# Altium schematic sheet Pulser.SchDoc
size A4; SheetNumber: 1; SheetTotal: 5
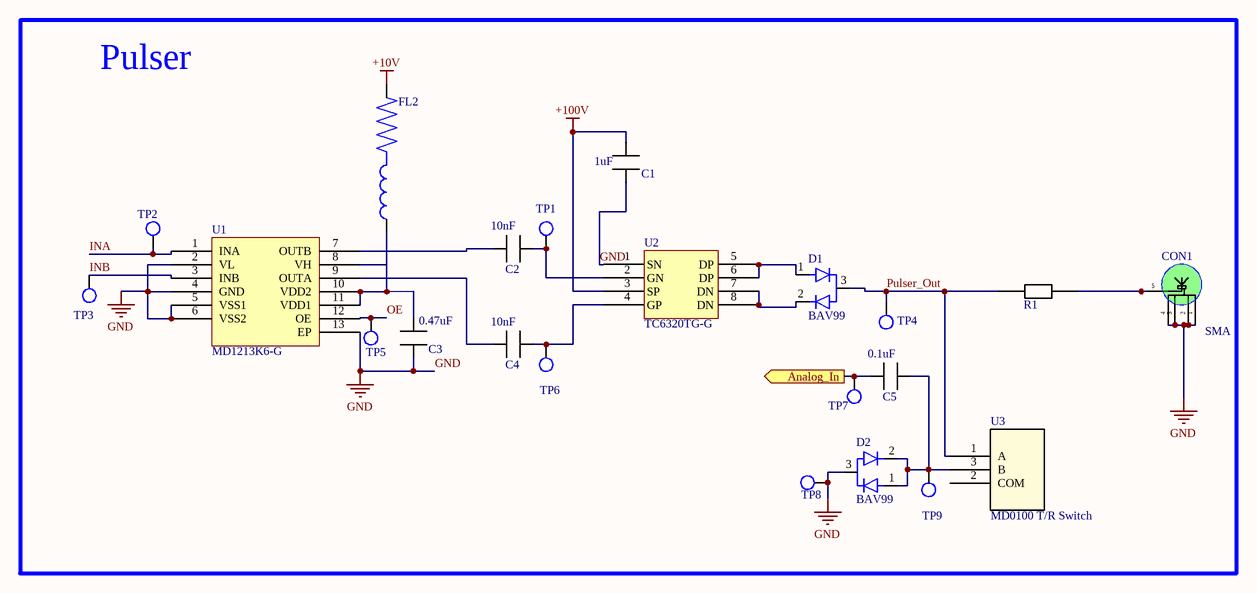
[diagram p0: Pulser.SchDoc]

## Parts
C1  1uF  [CAP_1206]
C2  10nF  [CAP_0805]
C3  0.47uF  [CAP_0805]
C4  10nF  [CAP_0805]
C5  0.1uF  [CAP_0805]
CON1  SMA  [A-SMA-KWE-15.1A]
D1  BAV99  [DIO_BAV99]
D2  BAV99  [DIO_BAV99]
FL2  (no value)  [BEAD1206S601A40T]
R1  200R  [RES_0805]  (value not drawn)
TP1  TP  [CON_TP]  (value not drawn)
TP2  TP  [CON_TP]  (value not drawn)
TP3  TP  [CON_TP]  (value not drawn)
TP4  TP  [CON_TP]  (value not drawn)
TP5  TP  [CON_TP]  (value not drawn)
TP6  TP  [CON_TP]  (value not drawn)
TP7  TP  [CON_TP]  (value not drawn)
TP8  TP  [CON_TP]  (value not drawn)
TP9  TP  [CON_TP]  (value not drawn)
U1  MD1213K6-G  [QFN80P400X400X90-13N]
U2  TC6320TG-G  [SOIC127P600X175-8N]
U3  MD0100 T/R Switch  [TO-243AA_MCH]

## Blocks framed on the sheet
Pulser: C1-C5 CON1 D1 D2 FL2 R1 TP1-TP9 U1-U3

## Ports
Analog_In (out)

## Nets
+10V: FL2.2
+100V: C1.2 U2.3(SP)
GND: C1.1 C3.2 CON1.1 CON1.2 CON1.3 CON1.4 D2.3 TP8.1(A1) U1.2(VL) U1.4(GND) U1.5(VSS1) U1.6(VSS2) U1.13(EP) U2.1(SN)
Analog_In: C5.1 TP7.1(A1) ; port Analog_In
INA: TP2.1(A1) U1.1(INA)
INB: TP3.1(A1) U1.3(INB)
OE: TP5.1(A1) U1.12(OE)
Pulser_Out: D1.3 R1.1 TP4.1(A1) U3.1(A)
NetC2_1: C2.1 U1.7(OUTB)
NetC2_2: C2.2 TP1.1(A1) U2.2(GN)
NetC3_1: C3.1 FL2.1 U1.8(VH) U1.10(VDD2) U1.11(VDD1)
NetC4_1: C4.1 U1.9(OUTA)
NetC4_2: C4.2 TP6.1(A1) U2.4(GP)
NetC5_2: C5.2 D2.1 D2.2 TP9.1(A1) U3.3(B)
NetCON1_5: CON1.5 R1.2
NetD1_1: D1.1 U2.5(DP) U2.6(DP)
NetD1_2: D1.2 U2.7(DN) U2.8(DN)

Not connected (* = marked no-connect by the designer): U3 2(COM)

## Library data of the parts
C1 = CAP_1206: note: any manufacturer; val: 1uF
C2-C5 = CAP_0805: note: any manufacturer
  C2 C4: val: 10nF
  C3: val: 0.47uF
  C5: val: 0.1uF
CON1 = A-SMA-KWE-15.1A: SMA Connector - 1 Inner Bore SMA Board Side Elbow 6GHz 50Ω 5.35mm Through Hole Coaxial Connector (RF) Adapters RoHS; val: MyAntenna A-SMA-KWE-15.1A; sample link: https://www.lcsc.com/product-detail/C49253491.html?s_z=n_SMA
D1 D2 = BAV99: Diode Array 1 Pair Series Connection Standard 100V 215mA (DC) Surface Mount TO-236-3, SC-59, SOT-23-3; MF: ON Semiconductor; Price: None; Availability: In Stock; MP: BAV99; Package: SOT-23-3 Motorola; SnapEDA_Link: https://www.snapeda.com/parts/BAV99/Onsemi/view-part/?ref=snap; Check_prices: https://www.snapeda.com/parts/BAV99/Onsemi/view-part/?ref=eda; Value: *; Purchase-URL: https://pricing.snapeda.com/search/part/BAV99/?ref=eda
FL2 = BEAD1206S601A40T: MF: Murata; MP: BLM03EB500SZ1D; SnapEDA_Link: https://www.snapeda.com/parts/BLM03EB500SZ1D/Murata/view-part/?ref=snap; Package: 0603 Murata; Value: *; Check_prices: https://www.snapeda.com/parts/BLM03EB500SZ1D/Murata/view-part/?ref=eda
R1 = RES_0805: note: any manufacturer; val: 200R
TP1-TP9 = Test_Point
U3 = MD0100N8-G: Description; Manufacturer_Name: Microchip; Copyright: Copyright (C) 2025 Ultra Librarian. All rights reserved.; Manufacturer_Part_Number: MD0100N8-G; RefDes: RefDes; Type: Type